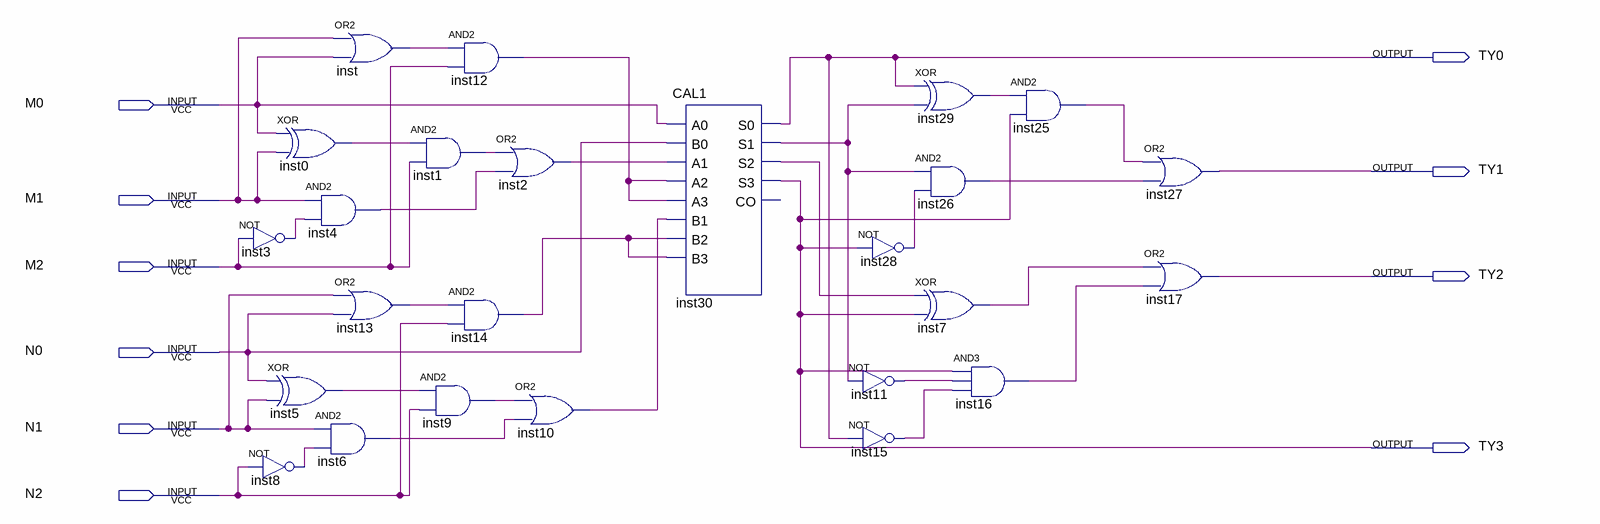
[diagram p0: schematic sheet]
// Quartus schematic CAL2.bdf as structural Verilog: 25 symbols, 10 pins
module CAL2 (
  input  M0,
  input  M1,
  input  M2,
  input  N0,
  input  N1,
  input  N2,
  output TY0,
  output TY1,
  output TY2,
  output TY3
);

  wire inst0_out, inst1_out, inst2_out, inst3_out, inst4_out, inst5_out, inst6_out, inst7_out, inst8_out,
       inst9_out, inst10_out, inst11_out, inst12_out, inst13_out, inst14_out, inst15_out, inst16_out,
       inst25_out, inst26_out, inst28_out, inst29_out, inst30_s1, inst30_s2, inst_out;

  not inst3 (inst3_out, M2);
  not inst8 (inst8_out, N2);
  xor inst0 (inst0_out, M0, M1);
  and inst4 (inst4_out, M1, inst3_out);
  xor inst5 (inst5_out, N0, N1);
  and inst6 (inst6_out, N1, inst8_out);
  or inst (inst_out, M1, M0);
  or inst13 (inst13_out, N1, N0);
  and inst12 (inst12_out, inst_out, M2);
  and inst1 (inst1_out, inst0_out, M2);
  and inst14 (inst14_out, inst13_out, N2);
  and inst9 (inst9_out, inst5_out, N2);
  or inst2 (inst2_out, inst1_out, inst4_out);
  or inst10 (inst10_out, inst9_out, inst6_out);
  CAL1 inst30 (
    .A0(M0), .B0(N0), .A1(inst2_out), .A2(inst12_out), .A3(inst12_out), .B1(inst10_out), .B2(inst14_out),
    .B3(inst14_out), .S0(TY0), .S1(inst30_s1), .S2(inst30_s2), .S3(TY3));  // open: CO
  not inst28 (inst28_out, TY3);
  not inst11 (inst11_out, inst30_s1);
  not inst15 (inst15_out, TY0);
  xor inst29 (inst29_out, TY0, inst30_s1);
  and inst26 (inst26_out, inst30_s1, inst28_out);
  xor inst7 (inst7_out, inst30_s2, TY3);
  and inst25 (inst25_out, inst29_out, TY3);
  and inst16 (inst16_out, TY3, inst11_out, inst15_out);
  or inst27 (TY1, inst25_out, inst26_out);
  or inst17 (TY2, inst7_out, inst16_out);
endmodule
